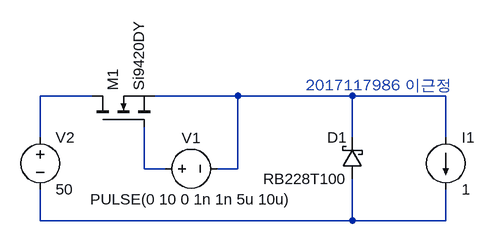
[diagram p0: schematic Draft1.asc]
Draft1.asc, the LTspice schematic file:
Version 4
SHEET 1 880 680
WIRE 16 112 -64 112
WIRE 240 112 112 112
WIRE 416 112 240 112
WIRE 560 112 416 112
WIRE -64 176 -64 112
WIRE 416 176 416 112
WIRE 560 176 560 112
WIRE 96 224 96 160
WIRE 128 224 96 224
WIRE 240 224 240 112
WIRE 240 224 208 224
WIRE -64 304 -64 256
WIRE 416 304 416 240
WIRE 416 304 -64 304
WIRE 560 304 560 256
WIRE 560 304 416 304
SYMBOL voltage 112 224 R270
WINDOW 0 32 56 VTop 2
WINDOW 3 -32 56 VBottom 2
WINDOW 123 0 0 Left 0
WINDOW 39 0 0 Left 0
SYMATTR InstName V1
SYMATTR Value PULSE(0 10 0 1n 1n 5u 10u)
SYMBOL voltage -64 160 R0
WINDOW 123 0 0 Left 0
WINDOW 39 0 0 Left 0
SYMATTR InstName V2
SYMATTR Value 50
SYMBOL nmos 16 160 R270
SYMATTR InstName M1
SYMATTR Value Si9420DY
SYMBOL schottky 432 240 R180
WINDOW 0 24 64 Left 2
WINDOW 3 24 0 Left 2
SYMATTR InstName D1
SYMATTR Value RB228T100
SYMATTR Description Diode
SYMATTR Type diode
SYMBOL current 560 176 R0
WINDOW 123 0 0 Left 0
WINDOW 39 0 0 Left 0
SYMATTR InstName I1
SYMATTR Value 1
TEXT 344 96 Left 2 ;2017117986 이근정

The netlist it stands for:
* Draft1.asc
V1 N003 N002 PULSE(0 10 0 1n 1n 5u 10u)
V2 N001 N004 50
M1 N001 N003 N002 N002 Si9420DY
D1 N004 N002 RB228T100
I1 N002 N004 1
.model D D
.lib standard.dio
.model NMOS NMOS
.model PMOS PMOS
.lib standard.mos
* 2017117986 이근정
.backanno
.end